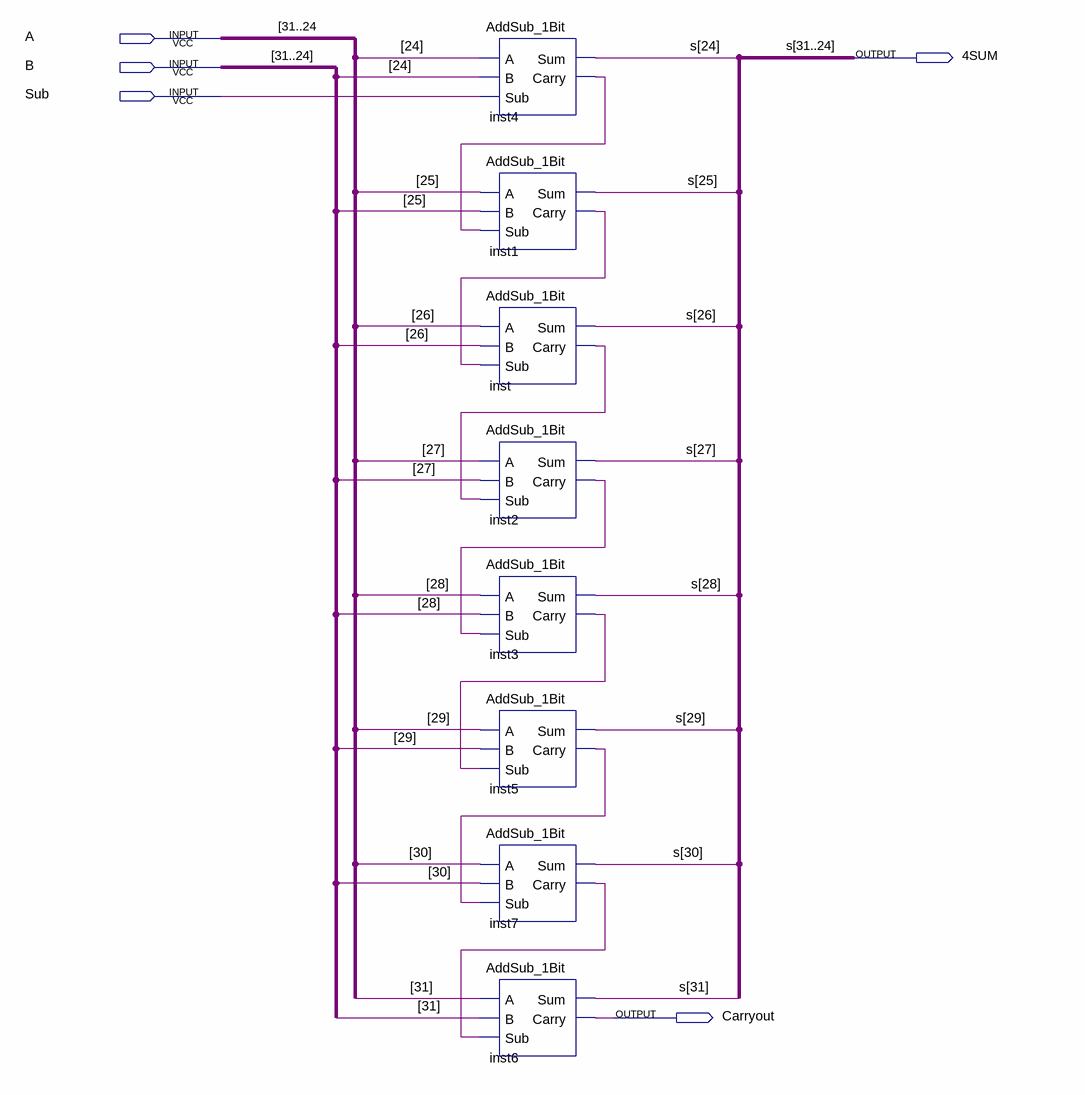
[diagram p0: schematic sheet]
// Quartus schematic Four8Bit_AddSub.bdf as structural Verilog: 8 symbols, 5 pins
module Four8Bit_AddSub (
  input  A,
  input  B,
  input  Sub,
  output \4SUM ,
  output Carryout
);

  wire inst1_carry, inst2_carry, inst3_carry, inst4_carry, inst5_carry, inst7_carry, inst_carry;
  wire [31:24] s;

  AddSub_1Bit inst4 (.A(A), .B(B), .Sub(Sub), .Sum(s[24]), .Carry(inst4_carry));
  AddSub_1Bit inst1 (.A(A), .B(B), .Sub(inst4_carry), .Sum(s[25]), .Carry(inst1_carry));
  AddSub_1Bit inst (.A(A), .B(B), .Sub(inst1_carry), .Sum(s[26]), .Carry(inst_carry));
  AddSub_1Bit inst2 (.A(A), .B(B), .Sub(inst_carry), .Sum(s[27]), .Carry(inst2_carry));
  AddSub_1Bit inst3 (.A(A), .B(B), .Sub(inst2_carry), .Sum(s[28]), .Carry(inst3_carry));
  AddSub_1Bit inst5 (.A(A), .B(B), .Sub(inst3_carry), .Sum(s[29]), .Carry(inst5_carry));
  AddSub_1Bit inst7 (.A(A), .B(B), .Sub(inst5_carry), .Sum(s[30]), .Carry(inst7_carry));
  AddSub_1Bit inst6 (.A(A), .B(B), .Sub(inst7_carry), .Sum(s[31]), .Carry(Carryout));

  // Other names for the same wires on the sheet: [31..24 = A
endmodule
